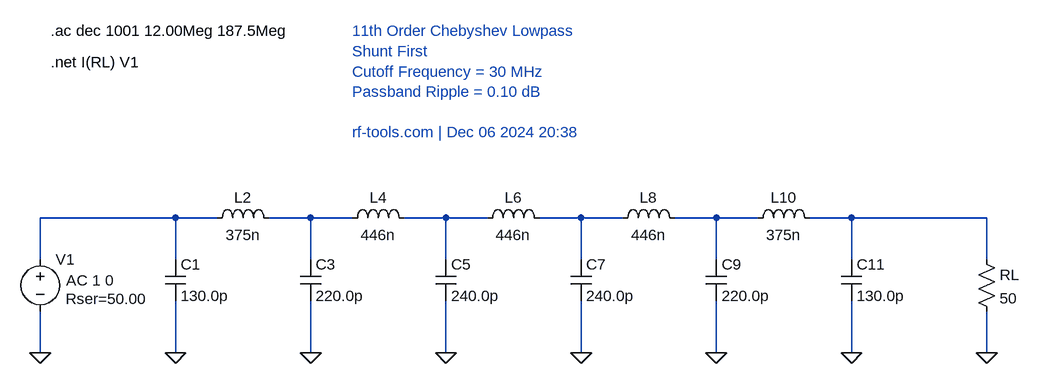
[diagram p0: schematic 10m_lpf.asc]
10m_lpf.asc, the LTspice schematic file:
Version 4
SHEET 1 1508 400
WIRE 208 0 0 0
WIRE 272 0 208 0
WIRE 416 0 352 0
WIRE 480 0 416 0
WIRE 624 0 560 0
WIRE 688 0 624 0
WIRE 832 0 768 0
WIRE 896 0 832 0
WIRE 1040 0 976 0
WIRE 1104 0 1040 0
WIRE 1248 0 1184 0
WIRE 1456 0 1248 0
WIRE 0 64 0 0
WIRE 208 64 208 0
WIRE 416 64 416 0
WIRE 624 64 624 0
WIRE 832 64 832 0
WIRE 1040 64 1040 0
WIRE 1248 64 1248 0
WIRE 1456 64 1456 0
WIRE 0 208 0 144
WIRE 208 208 208 128
WIRE 416 208 416 128
WIRE 624 208 624 128
WIRE 832 208 832 128
WIRE 1040 208 1040 128
WIRE 1248 208 1248 128
WIRE 1456 208 1456 144
FLAG 0 208 0
FLAG 208 208 0
FLAG 416 208 0
FLAG 624 208 0
FLAG 832 208 0
FLAG 1040 208 0
FLAG 1248 208 0
FLAG 1456 208 0
SYMBOL voltage 0 48 R0
WINDOW 123 40 48 Left 2
WINDOW 39 39 77 Left 2
SYMATTR Value2 AC 1 0
SYMATTR SpiceLine Rser=50.00
SYMATTR InstName V1
SYMATTR Value ""
SYMBOL cap 192 64 R0
SYMATTR InstName C1
SYMATTR Value 130.0p
SYMBOL ind 256 16 R270
WINDOW 0 32 56 VTop 2
WINDOW 3 5 56 VBottom 2
SYMATTR InstName L2
SYMATTR Value 375n
SYMBOL cap 400 64 R0
SYMATTR InstName C3
SYMATTR Value 220.0p
SYMBOL ind 464 16 R270
WINDOW 0 32 56 VTop 2
WINDOW 3 5 56 VBottom 2
SYMATTR InstName L4
SYMATTR Value 446n
SYMBOL cap 608 64 R0
SYMATTR InstName C5
SYMATTR Value 240.0p
SYMBOL ind 672 16 R270
WINDOW 0 32 56 VTop 2
WINDOW 3 5 56 VBottom 2
SYMATTR InstName L6
SYMATTR Value 446n
SYMBOL cap 816 64 R0
SYMATTR InstName C7
SYMATTR Value 240.0p
SYMBOL ind 880 16 R270
WINDOW 0 32 56 VTop 2
WINDOW 3 5 56 VBottom 2
SYMATTR InstName L8
SYMATTR Value 446n
SYMBOL cap 1024 64 R0
SYMATTR InstName C9
SYMATTR Value 220.0p
SYMBOL ind 1088 16 R270
WINDOW 0 32 56 VTop 2
WINDOW 3 5 56 VBottom 2
SYMATTR InstName L10
SYMATTR Value 375n
SYMBOL cap 1232 64 R0
SYMATTR InstName C11
SYMATTR Value 130.0p
SYMBOL res 1440 48 R0
SYMATTR InstName RL
SYMATTR Value 50
TEXT 16 -288 Left 2 !.ac dec 1001 12.00Meg 187.5Meg
TEXT 16 -240 Left 2 !.net I(RL) V1
TEXT 480 -288 Left 2 ;11th Order Chebyshev Lowpass\nShunt First\nCutoff Frequency = 30 MHz\nPassband Ripple = 0.10 dB\n\nrf-tools.com | Dec 06 2024 20:38

The netlist it stands for:
* 10m_lpf.asc
V1 N001 0 AC 1 0 Rser=50.00
C1 N001 0 130.0p
L2 N001 N002 375n
C3 N002 0 220.0p
L4 N002 N003 446n
C5 N003 0 240.0p
L6 N003 N004 446n
C7 N004 0 240.0p
L8 N004 N005 446n
C9 N005 0 220.0p
L10 N005 N006 375n
C11 N006 0 130.0p
RL N006 0 50
.ac dec 1001 12.00Meg 187.5Meg
.net I(RL) V1
* 11th Order Chebyshev Lowpass
* Shunt First
* Cutoff Frequency = 30 MHz
* Passband Ripple = 0.10 dB
* rf-tools.com | Dec 06 2024 20:38
.backanno
.end